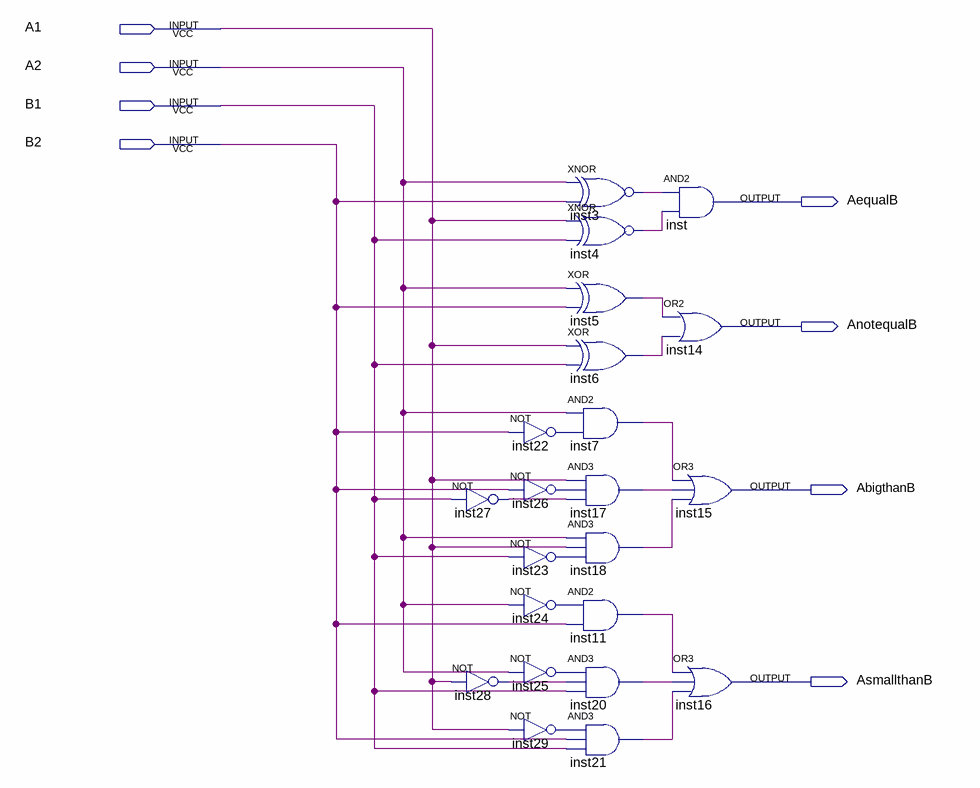
[diagram p0: schematic sheet]
// Quartus schematic twobitcompare.bdf as structural Verilog: 22 symbols, 8 pins
module twobitcompare (
  input  A1,
  input  A2,
  input  B1,
  input  B2,
  output AequalB,
  output AnotequalB,
  output AbigthanB,
  output AsmallthanB
);

  wire inst3_out, inst4_out, inst5_out, inst6_out, inst7_out, inst11_out, inst17_out, inst18_out, inst20_out,
       inst21_out, inst22_out, inst23_out, inst24_out, inst25_out, inst26_out, inst27_out, inst28_out,
       inst29_out;

  not inst27 (inst27_out, B1);
  not inst28 (inst28_out, A1);
  not inst22 (inst22_out, B2);
  not inst26 (inst26_out, B2);
  not inst23 (inst23_out, B1);
  not inst24 (inst24_out, A2);
  not inst25 (inst25_out, A2);
  not inst29 (inst29_out, A1);
  xnor inst3 (inst3_out, A2, B2);
  xnor inst4 (inst4_out, A1, B1);
  xor inst5 (inst5_out, A2, B2);
  xor inst6 (inst6_out, A1, B1);
  and inst7 (inst7_out, A2, inst22_out);
  and inst17 (inst17_out, A1, inst26_out, inst27_out);
  and inst18 (inst18_out, A2, A1, inst23_out);
  and inst11 (inst11_out, inst24_out, B2);
  and inst20 (inst20_out, inst25_out, inst28_out, B1);
  and inst21 (inst21_out, inst29_out, B2, B1);
  and inst (AequalB, inst3_out, inst4_out);
  or inst14 (AnotequalB, inst5_out, inst6_out);
  or inst15 (AbigthanB, inst7_out, inst17_out, inst18_out);
  or inst16 (AsmallthanB, inst11_out, inst20_out, inst21_out);
endmodule
